# Altium project PT-MIS-PCB-004_v1.PrjPcb
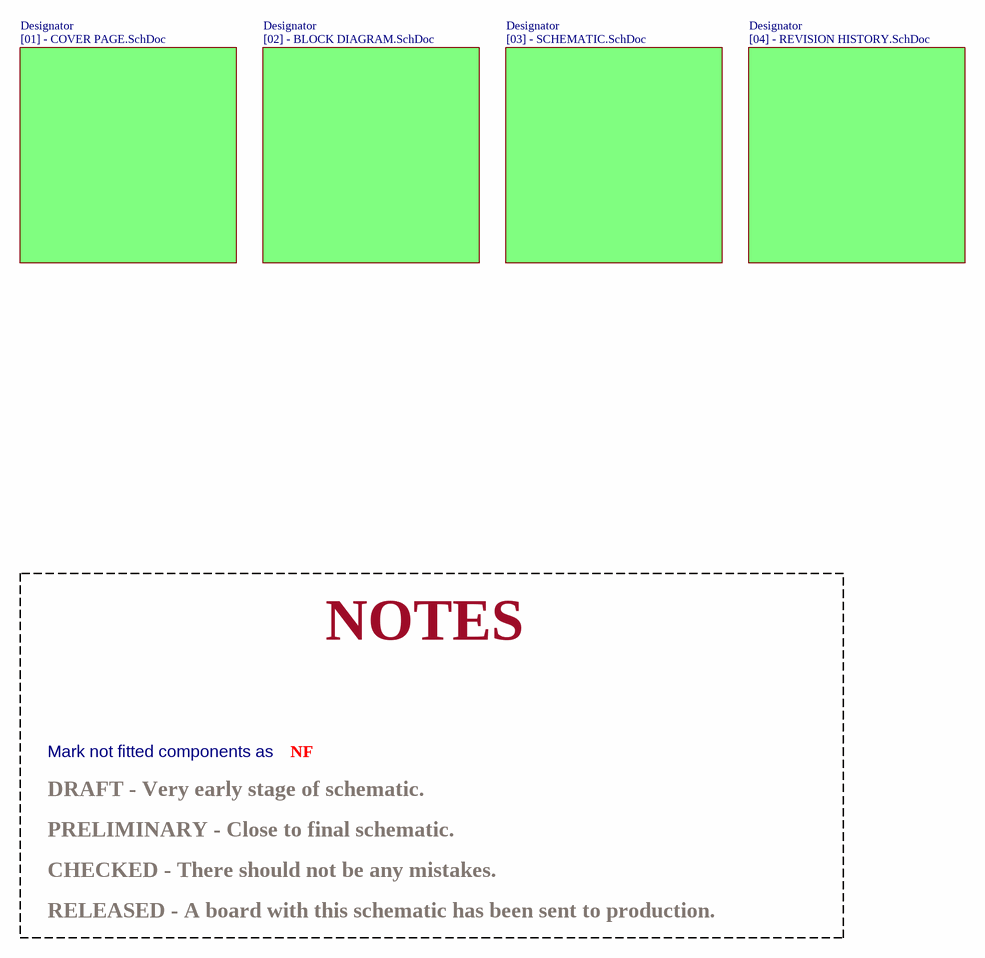
[diagram p0: PT-MIS-PCB-004_v1 Project.SchDoc]
Checked: JABN; DocumentRevision: v1
5 sheets, 68 parts. Net scope: global (net labels, ports and power ports of the same name join across sheets).
Board file: PT-MIS-PCB-004_v1.PcbDoc
Sheets:
  PT-MIS-PCB-004_v1 Project.SchDoc
    Designator = [01] - COVER PAGE.SchDoc
    Designator = [02] - BLOCK DIAGRAM.SchDoc
    Designator = [04] - REVISION HISTORY.SchDoc
    Designator = [03] - SCHEMATIC.SchDoc

## Sheet PT-MIS-PCB-004_v1 Project.SchDoc
size A4; DocumentNumber: 5; SheetNumber: 5; SheetTotal: 5

### Sub-sheets
Designator = [01] - COVER PAGE.SchDoc: no entries
Designator = [02] - BLOCK DIAGRAM.SchDoc: no entries
Designator = [04] - REVISION HISTORY.SchDoc: no entries
Designator = [03] - SCHEMATIC.SchDoc: no entries

### Notes on the sheet
- NOTES
- DRAFT - Very early stage of schematic.
- Mark not fitted components as
- NF
- PRELIMINARY - Close to final schematic.
- CHECKED - There should not be any mistakes.
- RELEASED - A board with this schematic has been sent to production.
- Project:
- Page Contents:
- Size:
- Revision:
- A4
- Document Number:
- Design:
- Date:
- Sheet
- of

## Sheet [01] - COVER PAGE.SchDoc
size A4; DocumentNumber: 1; SheetNumber: 1; SheetTotal: 5
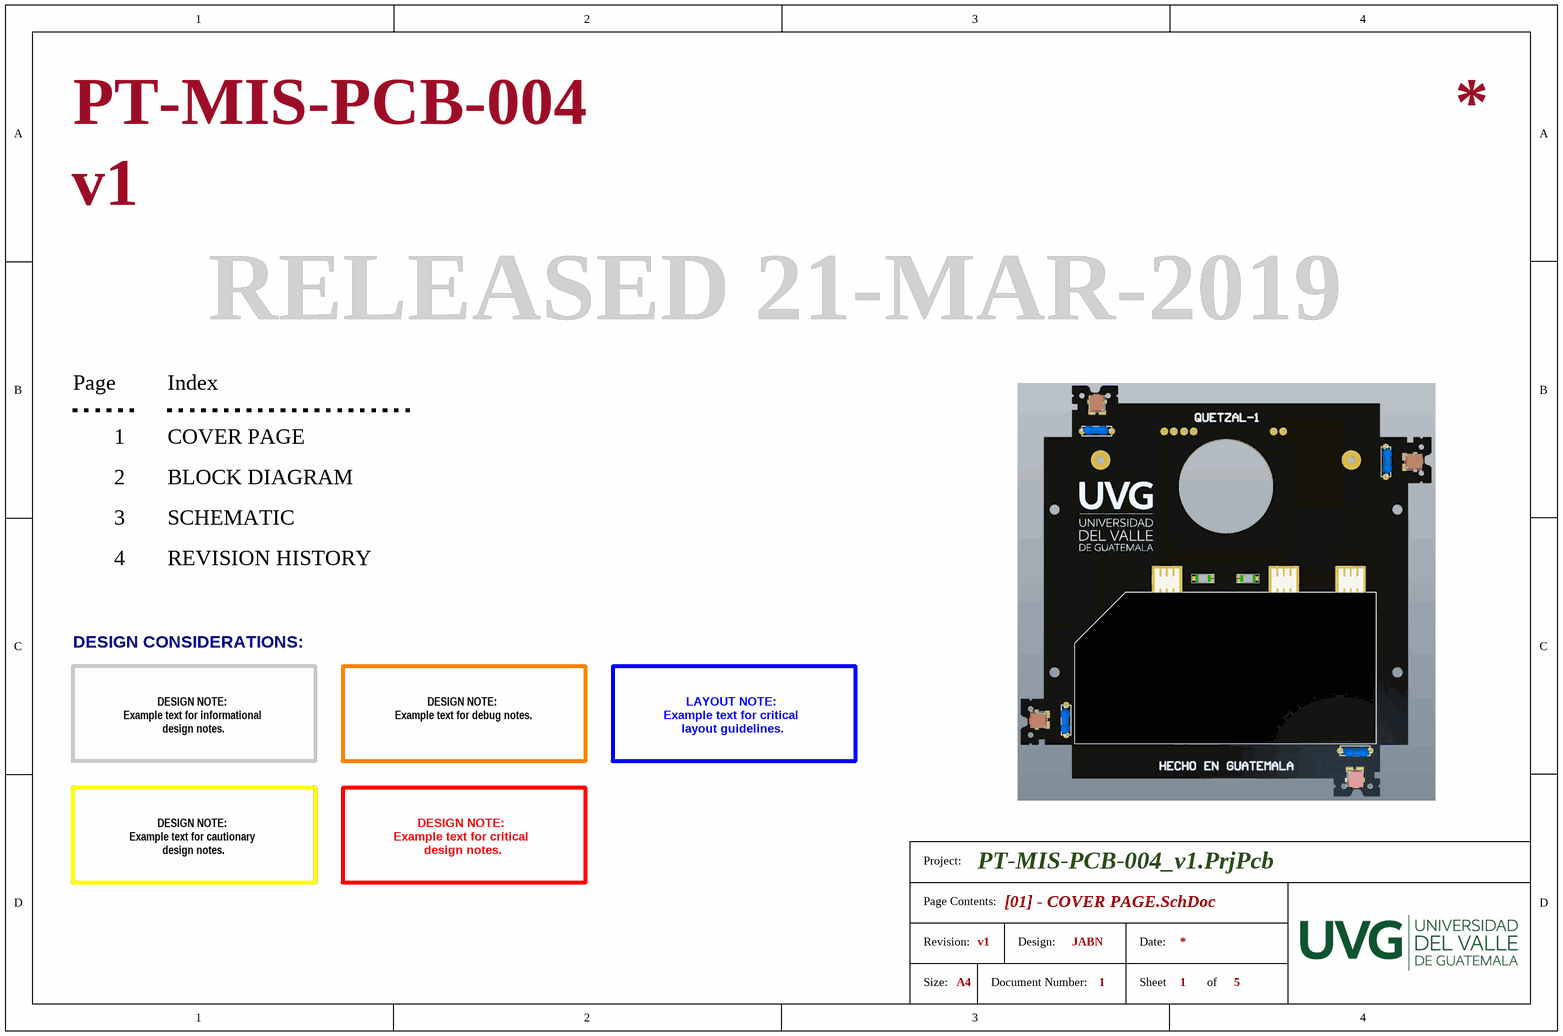
[diagram p1: [01] - COVER PAGE.SchDoc]

### Notes on the sheet
- PT-MIS-PCB-004
- RELEASED 21-MAR-2019
- Page
- 1
- Index
- COVER PAGE
- 2
- BLOCK DIAGRAM
- 3
- 4
- SCHEMATIC
- REVISION HISTORY
- DESIGN CONSIDERATIONS:
- DESIGN NOTE:
  Example text for debug notes.
- DESIGN NOTE:
  Example text for informational
  design notes.
- LAYOUT NOTE:
  Example text for critical
  layout guidelines.
- DESIGN NOTE:
  Example text for cautionary
  design notes.
- DESIGN NOTE:
  Example text for critical
  design notes.
- Project:
- Page Contents:
- Size:
- Revision:
- A4
- Document Number:
- Design:
- Date:
- Sheet
- of

## Sheet [02] - BLOCK DIAGRAM.SchDoc
size A4; DocumentNumber: 2; SheetNumber: 2; SheetTotal: 5
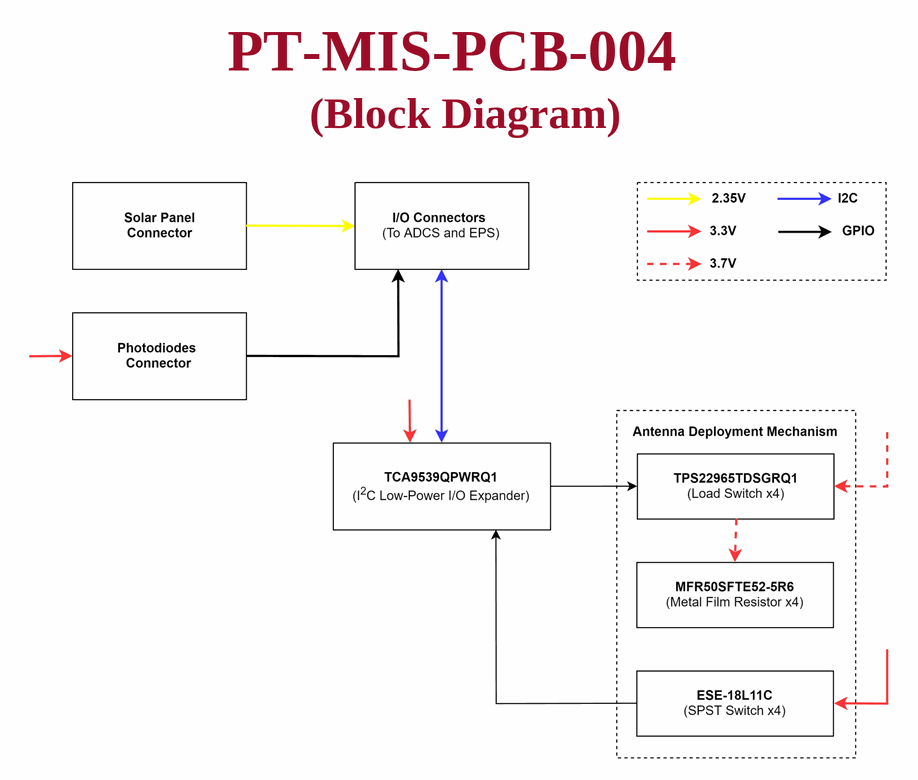
[diagram p2: [02] - BLOCK DIAGRAM.SchDoc]

### Notes on the sheet
- PT-MIS-PCB-004
- (Block Diagram)
- Project:
- Page Contents:
- Size:
- Revision:
- A4
- Document Number:
- Design:
- Date:
- Sheet
- of

## Sheet [04] - REVISION HISTORY.SchDoc
size A4; DocumentNumber: 4; SheetNumber: 4; SheetTotal: 5
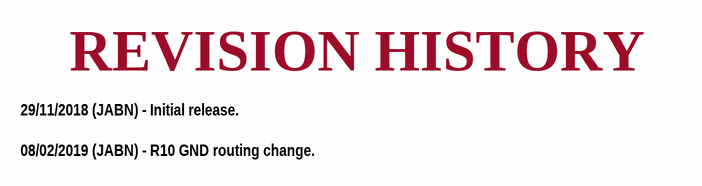
[diagram p3: [04] - REVISION HISTORY.SchDoc]

### Notes on the sheet
- 29/11/2018 (JABN) - Initial release.
- REVISION HISTORY
- 08/02/2019 (JABN) - R10 GND routing change.
- Project:
- Page Contents:
- Size:
- Revision:
- A4
- Document Number:
- Design:
- Date:
- Sheet
- of

## Sheet [03] - SCHEMATIC.SchDoc
size A2; DocumentNumber: 3; SheetNumber: 3; SheetTotal: 5
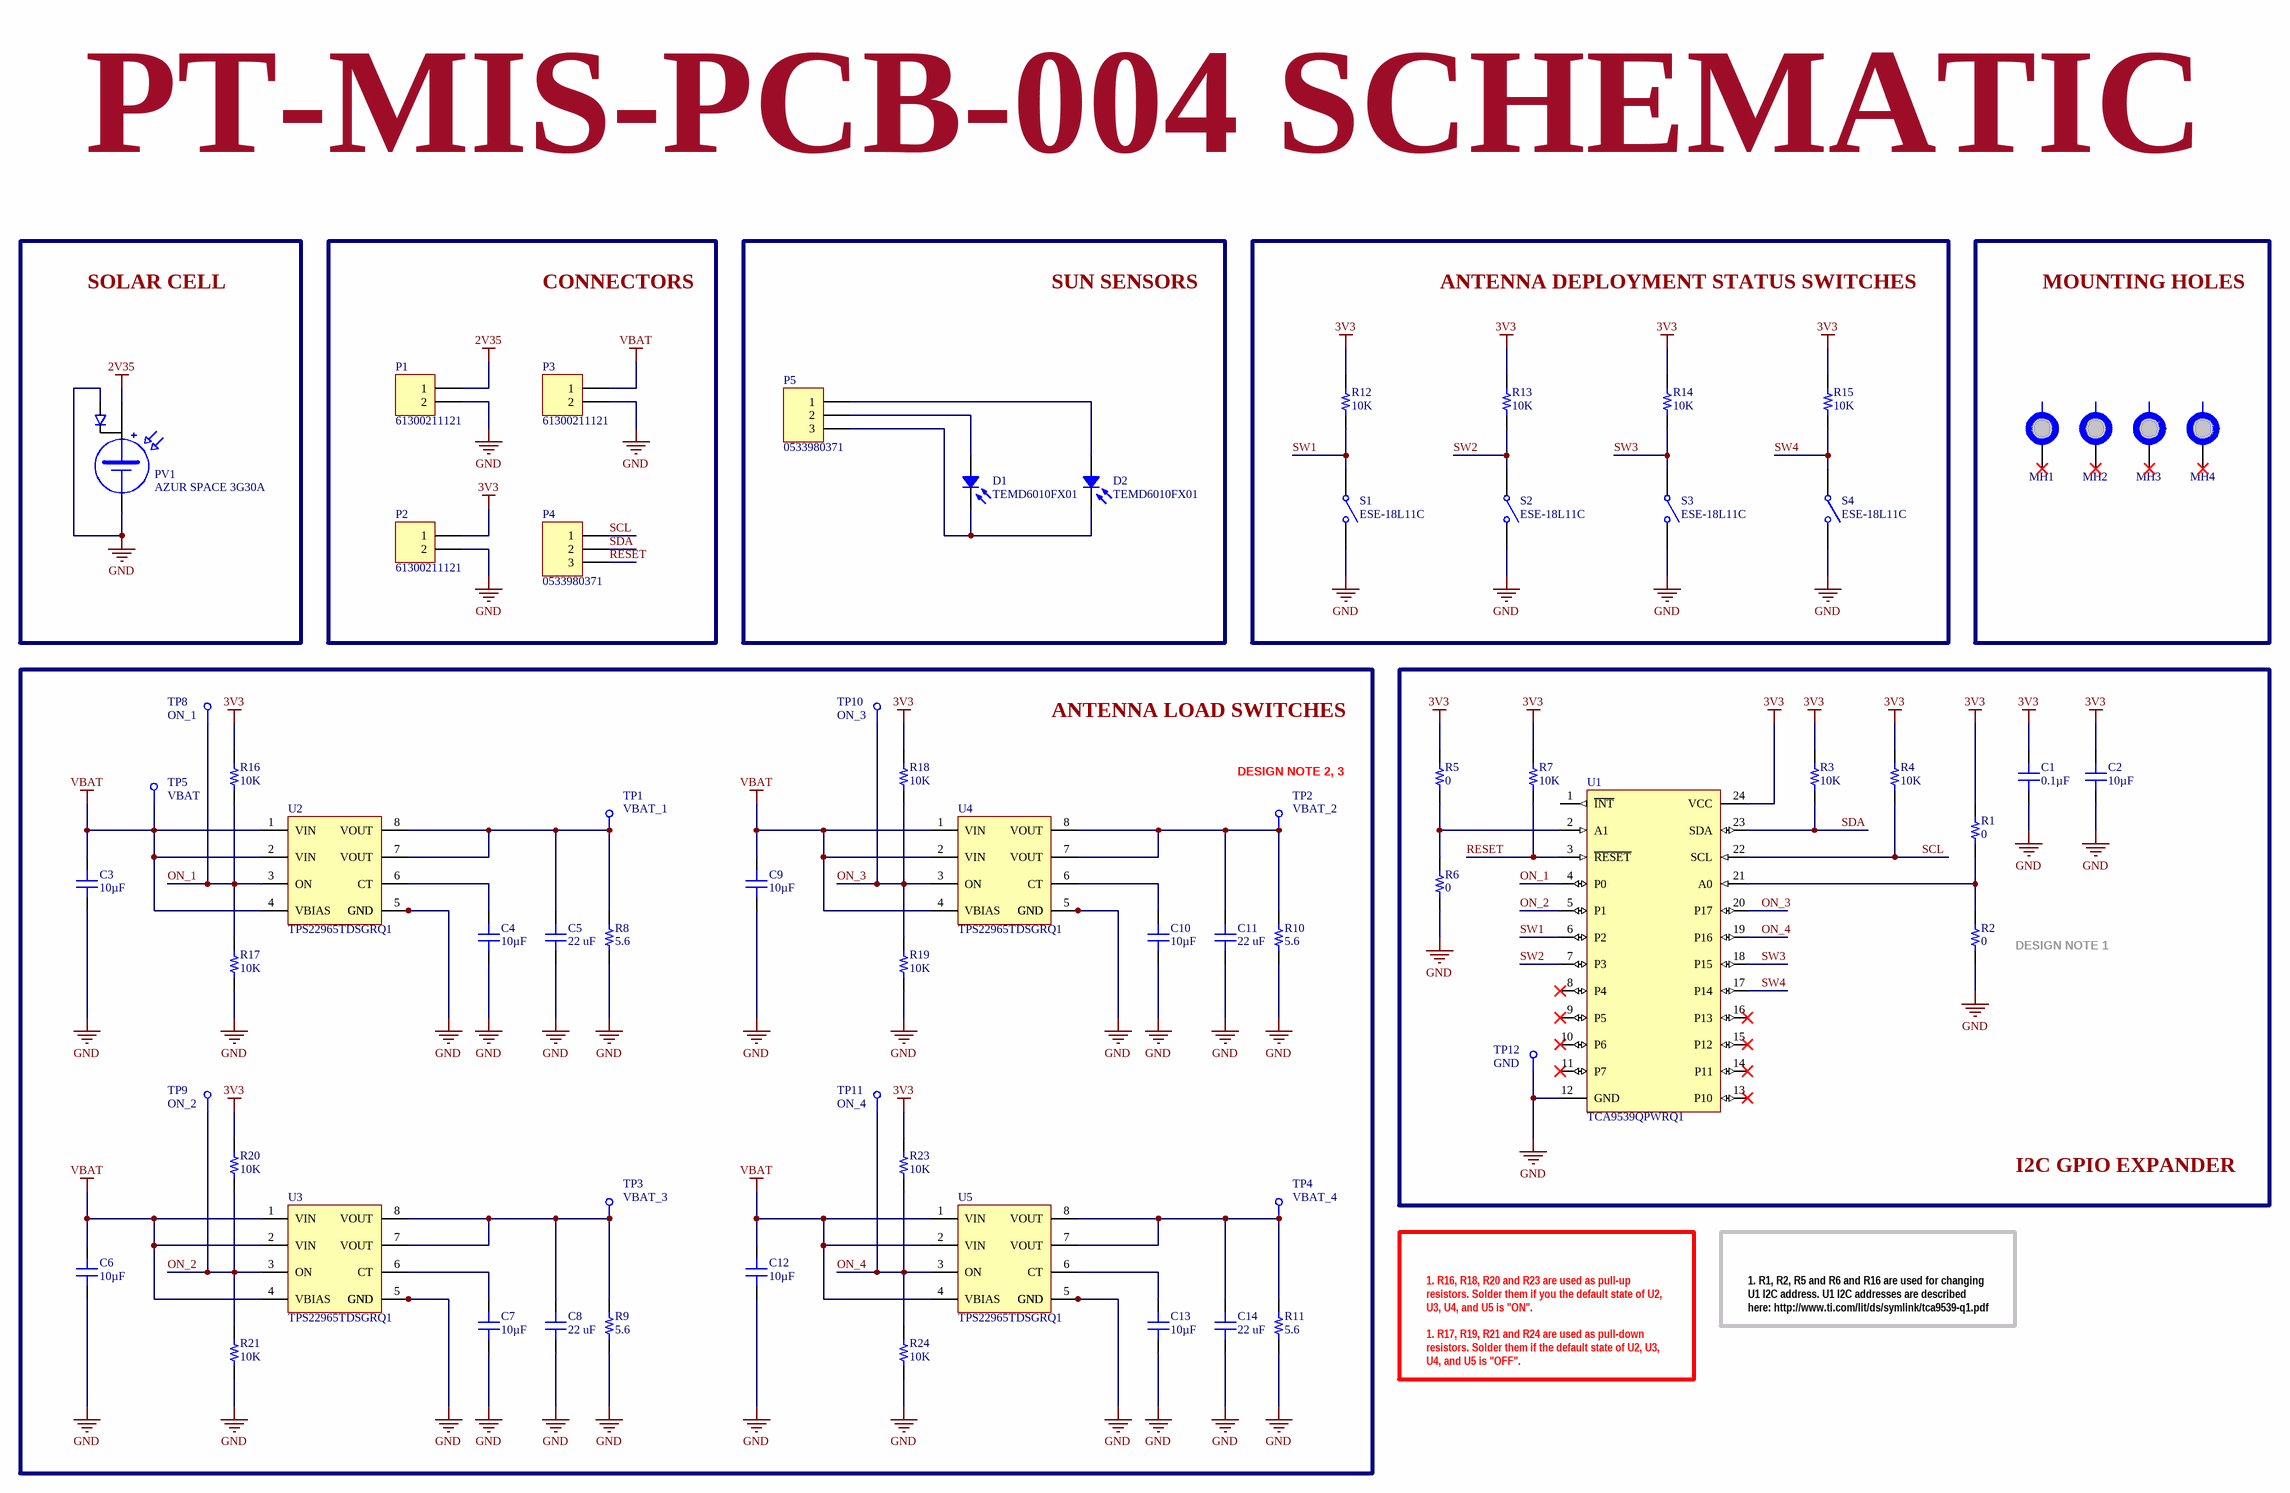
[diagram p4: [03] - SCHEMATIC.SchDoc]

### Parts
C1  0.1µF  [CAP 0805/2012]
C2  Capacitance: 10µF  [CAP 0805/2012]  (hidden comment: LMK212BJ106KG-T)
C3  Capacitance: 10µF  [CAP 0805/2012]  (hidden comment: LMK212BJ106KG-T)
C4  Capacitance: 10µF  [CAP 0805/2012]  (hidden comment: LMK212BJ106KG-T)
C5  Capacitance: 22 uF  [CAP 0805/2012]  (hidden comment: GRM21BR61E226ME44L)
C6  Capacitance: 10µF  [CAP 0805/2012]  (hidden comment: LMK212BJ106KG-T)
C7  Capacitance: 10µF  [CAP 0805/2012]  (hidden comment: LMK212BJ106KG-T)
C8  Capacitance: 22 uF  [CAP 0805/2012]  (hidden comment: GRM21BR61E226ME44L)
C9  Capacitance: 10µF  [CAP 0805/2012]  (hidden comment: LMK212BJ106KG-T)
C10  Capacitance: 10µF  [CAP 0805/2012]  (hidden comment: LMK212BJ106KG-T)
C11  Capacitance: 22 uF  [CAP 0805/2012]  (hidden comment: GRM21BR61E226ME44L)
C12  Capacitance: 10µF  [CAP 0805/2012]  (hidden comment: LMK212BJ106KG-T)
C13  Capacitance: 10µF  [CAP 0805/2012]  (hidden comment: LMK212BJ106KG-T)
C14  Capacitance: 22 uF  [CAP 0805/2012]  (hidden comment: GRM21BR61E226ME44L)
D1  TEMD6010FX01  [TEMD6010FX01]
D2  TEMD6010FX01  [TEMD6010FX01]
MH1  MH_3.8MMNC_2.5MMD  [MH_3.8MMNC_2.5MMD_NON_COPPER_NPTH]  (value not drawn)  (no BOM)
MH2  MH_3.8MMNC_2.5MMD  [MH_3.8MMNC_2.5MMD_NON_COPPER_NPTH]  (value not drawn)  (no BOM)
MH3  MH_3.8MMNC_2.5MMD  [MH_3.8MMNC_2.5MMD_NON_COPPER_NPTH]  (value not drawn)  (no BOM)
MH4  MH_3.8MMNC_2.5MMD  [MH_3.8MMNC_2.5MMD_NON_COPPER_NPTH]  (value not drawn)  (no BOM)
P1  61300211121  [61300211121]
P2  61300211121  [61300211121]
P3  61300211121  [61300211121]
P4  0533980371  [0533980371]
P5  0533980371  [0533980371]
PV1  AZUR SPACE 3G30A  [AZUR SPACE 3G30A]
R1  0  [RES 0805/2012]
R2  0  [RES 0805/2012]
R3  10K  [RES 0805/2012]
R4  10K  [RES 0805/2012]
R5  0  [RES 0805/2012]
R6  0  [RES 0805/2012]
R7  10K  [RES 0805/2012]
R8  5.6  [MFR50SFTE52-5R6]
R9  5.6  [MFR50SFTE52-5R6]
R10  5.6  [MFR50SFTE52-5R6]
R11  5.6  [MFR50SFTE52-5R6]
R12  10K  [RES 0805/2012]
R13  10K  [RES 0805/2012]
R14  10K  [RES 0805/2012]
R15  10K  [RES 0805/2012]
R16  10K  [RES 0805/2012]
R17  10K  [RES 0805/2012]
R18  10K  [RES 0805/2012]
R19  10K  [RES 0805/2012]
R20  10K  [RES 0805/2012]
R21  10K  [RES 0805/2012]
R23  10K  [RES 0805/2012]
R24  10K  [RES 0805/2012]
S1  ESE-18L11C  [ESE-18L11C]
S2  ESE-18L11C  [ESE-18L11C]
S3  ESE-18L11C  [ESE-18L11C]
S4  ESE-18L11C  [ESE-18L11C]
TP1  Testpoint  [Testpoint]  (value not drawn)
TP2  Testpoint  [Testpoint]  (value not drawn)
TP3  Testpoint  [Testpoint]  (value not drawn)
TP4  Testpoint  [Testpoint]  (value not drawn)
TP5  Testpoint  [Testpoint]  (value not drawn)
TP8  ON_1  [Testpoint]
TP9  ON_2  [Testpoint]
TP10  ON_3  [Testpoint]
TP11  ON_4  [Testpoint]
TP12  GND  [Testpoint]
U1  TCA9539QPWRQ1  [TSOP65P640X120-24N]
U2  TPS22965TDSGRQ1  [SON50P200X80_HS-9N]
U3  TPS22965TDSGRQ1  [SON50P200X80_HS-9N]
U4  TPS22965TDSGRQ1  [SON50P200X80_HS-9N]
U5  TPS22965TDSGRQ1  [SON50P200X80_HS-9N]

### Blocks framed on the sheet
SOLAR CELL: PV1
CONNECTORS: P1-P4
SUN SENSORS: D1 D2 P5
ANTENNA DEPLOYMENT STATUS SWITCHES: R12-R15 S1-S4
MOUNTING HOLES: MH1-MH4
ANTENNA LOAD SWITCHES: C3-C14 R8-R11 R16-R21 R23 R24 TP1-TP5 TP8-TP11 U2-U5
I2C GPIO EXPANDER: C1 C2 R1-R7 TP12 U1

### Nets
2V35: P1.1 PV1.1
3V3: C1.2 C2.2 P2.1 R1.2 R3.2 R4.2 R5.2 R7.2 R12.2 R13.2 R14.2 R15.2 R16.2 R18.2 R20.2 R23.2 U1.24(VCC)
GND: C1.1 C2.1 C3.1 C4.2 C5.1 C6.1 C7.2 C8.1 C9.1 C10.2 C11.1 C12.1 C13.2 C14.1 P1.2 P2.2 P3.2 PV1.2 PV1.3 R2.1 R6.1 R8.1 R9.1 R10.1 R11.1 R17.1 R19.1 R21.1 R24.1 S1.2(NO) S2.2(NO) S3.2(NO) S4.2(NO) TP12.1 U1.12(GND) U2.5(GND) U2.9(GND) U3.5(GND) U3.9(GND) U4.5(GND) U4.9(GND) U5.5(GND) U5.9(GND)
VBAT: C3.2 C6.2 C9.2 C12.2 P3.1 TP5.1 U2.1(VIN) U2.2(VIN) U2.4(VBIAS) U3.1(VIN) U3.2(VIN) U3.4(VBIAS) U4.1(VIN) U4.2(VIN) U4.4(VBIAS) U5.1(VIN) U5.2(VIN) U5.4(VBIAS)
ON_1: R16.1 R17.2 TP8.1 U1.4(P0) U2.3(ON)
ON_2: R20.1 R21.2 TP9.1 U1.5(P1) U3.3(ON)
ON_3: R18.1 R19.2 TP10.1 U1.20(P17) U4.3(ON)
ON_4: R23.1 R24.2 TP11.1 U1.19(P16) U5.3(ON)
RESET: P4.3 R7.1 U1.3(~{RESET})
SCL: P4.1 R4.1 U1.22(SCL)
SDA: P4.2 R3.1 U1.23(SDA)
SW1: R12.1 S1.1(COMMON) U1.6(P2)
SW2: R13.1 S2.1(COMMON) U1.7(P3)
SW3: R14.1 S3.1(COMMON) U1.18(P15)
SW4: R15.1 S4.1(COMMON) U1.17(P14)
NetC4_1: C4.1 U2.6(CT)
NetC5_2: C5.2 R8.2 TP1.1 U2.7(VOUT) U2.8(VOUT)
NetC7_1: C7.1 U3.6(CT)
NetC8_2: C8.2 R9.2 TP3.1 U3.7(VOUT) U3.8(VOUT)
NetC10_1: C10.1 U4.6(CT)
NetC11_2: C11.2 R10.2 TP2.1 U4.7(VOUT) U4.8(VOUT)
NetC13_1: C13.1 U5.6(CT)
NetC14_2: C14.2 R11.2 TP4.1 U5.7(VOUT) U5.8(VOUT)
NetD1_1: D1.1 P5.2
NetD1_2: D1.2 D2.2 P5.3
NetD2_1: D2.1 P5.1
NetR1_1: R1.1 R2.2 U1.21(A0)
NetR5_1: R5.1 R6.2 U1.2(A1)

Not connected (* = marked no-connect by the designer): MH1 1; MH2 1; MH3 1; MH4 1; U1 1(~{INT}) 8(P4)* 9(P5)* 10(P6)* 11(P7)* 13(P10)* 14(P11)* 15(P12)* 16(P13)*

### Notes on the sheet
- PT-MIS-PCB-004 SCHEMATIC
- (near TP5) VBAT
- (near TP1) VBAT_1
- (near TP2) DESIGN NOTE 2, 3
- (near TP2) VBAT_2
- (near R2) DESIGN NOTE 1
- (near TP3) VBAT_3
- (near TP4) VBAT_4
- DESIGN NOTES
- 1. R16, R18, R20 and R23 are used as pull-up resistors. Solder them if you the default state of U2, U3, U4, and U5 is "ON".
- 1. R1, R2, R5 and R6 and R16 are used for changing U1 I2C address. U1 I2C addresses are described here: http://www.ti.com/lit/ds/symlink/tca9539-q1.pdf
- 1. R17, R19, R21 and R24 are used as pull-down resistors. Solder them if the default state of U2, U3, U4, and U5 is "OFF".
- Project:
- Page Contents:
- Size:
- Revision:
- A2
- Document Number:
- Design:
- Date:
- Sheet
- of

### Library data of the parts
C1 = C0805C104Z3VACTU: Multilayer Ceramic Capacitors MLCC - SMD/SMT 25volts 0.1uF Y5V -20+80%; Manufacturer: KEMET; Part # Aliases: C0805C104Z3VAC7800; Capacitance - nF: 100 nF; Capacitance - pF: 100000 pF; Voltage Rating: 25 V; Tolerance: - 20 %, + 80 %; Case Height: 0.9 mm; Case Length: 2 mm; Case Width: 1.2 mm; Class: 3; Dissipation Factor DF: 7; Temperature Coefficient / Code: - 82 %, + 22 %; Type: Y5V Dielectric, Commercial; Supplier 1: Digi-Key; Manufacturer Part Number: C0805C104Z3VACTU; Stock 1: 70310; Pricing 1: 1=0.1, 10=0.065, 100=0.0289, 500=0.0207, 1000=0.0162 (USD); Dimensions: 1.2 mm W x 2 mm L x 0.9 mm H; Product Category: Multilayer Ceramic Capacitors MLCC - SMD/SMT; RoHS: Details; Brand: Kemet; Capacitance: 0.1 uF; Voltage Rating DC: 25 V; Dielectric: Y5V; Case Code - in: 0805; Case Code - mm: 2012; Minimum Operating Temperature: - 30 C; Maximum Operating Temperature: + 85 C; Product: General Type MLCCs; Lead Spacing: 0.75 mm; Operating Temperature Range: - 30 C to + 85 C; Package / Case: 0805 (2012 metric); Packaging: Reel; Series: C0805C; Factory Pack Quantity: 4000; Termination Style: SMD/SMT; ComponentLink1URL: http://www.farnell.com/datasheets/2112180.pdf; ComponentLink1Description: http://www.farnell.com/datasheets/2112180.pdf; ComponentLink2URL: http://www.mouser.com/ds/2/212/KEM_C1005_Y5V_SMD-1101305.pdf; ComponentLink2Description: http://www.mouser.com/ds/2/212/KEM_C1005_Y5V_SMD-1101305.pdf; ComponentLink3URL: https://search.kemet.com/component-edge/download/datasheet/C0805C104Z3VACTU.pdf; ComponentLink3Description: https://search.kemet.com/component-edge/download/datasheet/C0805C104Z3VACTU.pdf; ComponentLink4URL: http://capacitoredge.kemet.com/capedge2/DataSheet?pn=C0805C104Z3VACTU; ComponentLink4Description: http://capacitoredge.kemet.com/capedge2/DataSheet?pn=C0805C104Z3VACTU; ComponentLink5URL: http://components.arrow.com/part/dataview/2091117S3443012N7429; ComponentLink5Description: http://components.arrow.com/part/dataview/2091117S3443012N7429; Supplier Part Number 1: 399-9158-1-ND
C2-C4 C6 C7 C9 C10 C12 C13 = LMK212BJ106KG-T: CAP CER 10UF 10V X5R 0805; Manufacturer: Taiyo Yuden; PCN Part Number: X5R, X7R Dielectrics 23/Jan/2008; Catalog Drawings: xMK Series_0805_1.25; Featured Product: Multilayer Chip Capacitors; Tolerance: ±10%; Online Catalog: M Series; Kits: 587-1797-KIT-ND  - KIT CAP CER HI CAP 0603 & 0805 S; Other Names: 587-1300-1; Supplier 1: Digi-Key; Manufacturer Part Number: LMK212BJ106KG-T; Stock 1: 858762; Pricing 1: 1=0.14, 10=0.1, 100=0.0468, 500=0.0328, 1000=0.0272 (USD); Standard Package: 1; Category: Capacitors; Family: Ceramic Capacitors; Series: M; Packaging: Cut Tape (CT); Voltage - Rated: 10V; Temperature Coefficient: X5R; Mounting Type: Surface Mount, MLCC; Operating Temperature: -55°C ~ 85°C; Applications: General Purpose; Ratings: -; Package / Case: 0805 (2012 Metric); Size / Dimension: 0.079" L x 0.049" W (2.00mm x 1.25mm); Height - Seated (Max): -; Thickness (Max): 0.053" (1.35mm); Lead Spacing: -; Features: -; Lead Style: -; ComponentLink1URL: https://datasheet.ciiva.com/26872/getdatasheetpartid-638410-26872692.pdf; ComponentLink1Description: https://datasheet.ciiva.com/26872/getdatasheetpartid-638410-26872692.pdf; ComponentLink2URL: https://datasheet.ciiva.com/7975/1497285-7975797.pdf; ComponentLink2Description: https://datasheet.ciiva.com/7975/1497285-7975797.pdf; ComponentLink3URL: https://datasheet.ciiva.com/7975/1497285-7975799.pdf; ComponentLink3Description: https://datasheet.ciiva.com/7975/1497285-7975799.pdf; ComponentLink4URL: https://datasheet.ciiva.com/135/mlcc-all-e-135133.pdf; ComponentLink4Description: https://datasheet.ciiva.com/135/mlcc-all-e-135133.pdf; ComponentLink5URL: https://datasheet.ciiva.com/135/mlcc-all-e-135134.pdf; ComponentLink5Description: https://datasheet.ciiva.com/135/mlcc-all-e-135134.pdf; ComponentLink6URL: https://datasheet.ciiva.com/30259/719lmk212abj106kg-t-30259022.pdf; ComponentLink6Description: https://datasheet.ciiva.com/30259/719lmk212abj106kg-t-30259022.pdf; ComponentLink7URL: https://datasheet.ciiva.com/135/mlcc-all-e-135135.pdf; ComponentLink7Description: https://datasheet.ciiva.com/135/mlcc-all-e-135135.pdf; Supplier Part Number 1: 587-1300-1-ND
C5 C8 C11 C14 = GRM21BR61E226ME44L: MURATA         GRM21BR61E226ME44L             SMD Multilayer Ceramic Capacitor, 0805 [2012 Metric], 22 F, 25 V,  20%, X5R, GRM Series; Voltage Rating DC: 25 VDC; Brand: Murata Electronics; Class: Class 2; Type: General Purpose Ceramic Capacitors; Unit Weight: 0.000335 oz; Supplier 1: Digi-Key; Manufacturer: Murata; Manufacturer Part Number: GRM21BR61E226ME44L; Stock 1: 146; Pricing 1: 1=0.46, 10=0.316, 100=0.1898, 500=0.1423, 1000=0.1202 (USD); Product Category: Multilayer Ceramic Capacitors MLCC - SMD/SMT; RoHS: True; Dielectric: X5R; Tolerance: 20 %; Case Code - in: 0805; Case Code - mm: 2012; Height: 1.25 mm; Maximum Operating Temperature: + 85 C; Minimum Operating Temperature: - 55 C; Product: General Type MLCCs; Series: GRM; Packaging: Reel; Length: 2 mm; Package / Case: 0805 (2012 metric); Factory Pack Quantity: 3000; Termination Style: SMD/SMT; Width: 1.25 mm; ComponentLink1URL: https://datasheet.ciiva.com/22787/1747471-22787265.pdf; ComponentLink1Description: https://datasheet.ciiva.com/22787/1747471-22787265.pdf; ComponentLink2URL: https://datasheet.ciiva.com/7719/1747471-7719095.pdf; ComponentLink2Description: https://datasheet.ciiva.com/7719/1747471-7719095.pdf; ComponentLink3URL: https://datasheet.ciiva.com/28584/1747471-28584199.pdf; ComponentLink3Description: https://datasheet.ciiva.com/28584/1747471-28584199.pdf; Supplier Part Number 1: 490-10749-1-ND
D1 D2 = TEMD6010FX01: Ambient Light Sensor; Manufacturer: Vishay Semiconductors; Product Training Modules: Ambient Light Sensors; Catalog Drawings: TEMx60x0(F)X01; Featured Product: Surface-Mount Ambient Light Sensing Photodiodes; Wavelength: 540nm; Spectral Range: 430nm ~ 610nm; Diode Type: PIN; Voltage - DC Reverse (Vr) (Max): 16V; Current - Dark (Typ): 2nA; Active Area: 0.27mm²; Viewing Angle: 120°; Other Names: 751-1051-2; Supplier 1: Digi-Key; Manufacturer Part Number: TEMD6010FX01; Stock 1: 29; Pricing 1: 1=2.26, 10=1.998, 25=1.4824, 100=1.2892, 250=1.1603, 500=1.0314, 1000=0.8863 (USD); Standard Package: 3,000; Category: Sensors, Transducers; Family: Optical Sensors - Photodiodes; Packaging: Tape & Reel (TR); Operating Temperature: -40°C ~ 100°C; Mounting Type: Surface Mount; Online Catalog: Ambient Light Sensor; ComponentLink1URL: https://datasheet.ciiva.com/8280/temd6010-8280593.pdf; ComponentLink1Description: https://datasheet.ciiva.com/8280/temd6010-8280593.pdf; ComponentLink2URL: https://datasheet.ciiva.com/1252/temd6010-1252130.pdf; ComponentLink2Description: https://datasheet.ciiva.com/1252/temd6010-1252130.pdf; ComponentLink3URL: https://datasheet.ciiva.com/2819/temd6010-2819730.pdf; ComponentLink3Description: https://datasheet.ciiva.com/2819/temd6010-2819730.pdf; ComponentLink4URL: https://datasheet.ciiva.com/2819/temd6010-2819731.pdf; ComponentLink4Description: https://datasheet.ciiva.com/2819/temd6010-2819731.pdf; ComponentLink5URL: https://datasheet.ciiva.com/2819/temd6010-2819732.pdf; ComponentLink5Description: https://datasheet.ciiva.com/2819/temd6010-2819732.pdf; ComponentLink6URL: https://datasheet.ciiva.com/4270/temd6010-4270070.pdf; ComponentLink6Description: https://datasheet.ciiva.com/4270/temd6010-4270070.pdf; ComponentLink7URL: https://datasheet.ciiva.com/46430/1794172-46430214.pdf; ComponentLink7Description: https://datasheet.ciiva.com/46430/1794172-46430214.pdf; ComponentLink8URL: https://datasheet.ciiva.com/1249/temd6010-1249179.pdf; ComponentLink8Description: https://datasheet.ciiva.com/1249/temd6010-1249179.pdf; ComponentLink9URL: https://datasheet.ciiva.com/4697/temd6010-102586-4697659.pdf; ComponentLink9Description: https://datasheet.ciiva.com/4697/temd6010-102586-4697659.pdf; Supplier Part Number 1: 751-1051-1-ND
MH1-MH4 = MH_3.8MMNC_2MMD: Mounting Hole 3.8mm Diameter (Non Copper), 2.5mm Drill NPTH
P1-P3 = 61300211121: Headers & Wire Housings WR-PHD 2.54mm Header 2P THT; Manufacturer: Wurth Electronics; Current Rating: 3A; Voltage Rating: 250V; Number of Positions: 2; Gender: Male; Connector Type: Male Pin; Pitch: 0.1inch; Supplier 1: Digi-Key; Manufacturer Part Number: 61300211121; Stock 1: 98753; Pricing 1: 1=0.13, 10=0.106, 25=0.088, 50=0.074, 100=0.067, 1000=0.061 (USD); Mount: Through Hole; Contact Plating: Gold; Housing Material: PBT; Contact Material: Copper,Copper Alloy; Colour: Black; Min Operating Temperature: -40°C; Max Operating Temperature: 125°C; Number of Rows: 1; Contact Gender: Male; Packaging: Bulk; Termination: Through Hole; Number of Contacts: 2; Contact Mating Length: 0.236inch; REACH SVHC: Unknown; Lead Free: Lead Free; ComponentLink1URL: https://datasheet.ciiva.com/13619/6130xx11121-48870-13619345.pdf; ComponentLink1Description: https://datasheet.ciiva.com/13619/6130xx11121-48870-13619345.pdf; Supplier Part Number 1: 732-5315-ND
P4 P5 = 0533980371: 3 Positions Header, Shrouded Connector 0.049" (1.25mm) Surface Mount, Vertical Tin; Manufacturer: Molex; Number of Positions: 3; Number of Positions Loaded: All; Supplier 1: Digi-Key; Manufacturer Part Number: 0533980371; Stock 1: 26974; Pricing 1: 1=1.07, 10=0.942, 100=0.8126, 500=0.6649 (USD); Category: Connectors, Interconnects; Family: Rectangular Connectors - Headers, Male Pins; Series: PicoBlade™ 53398; Packaging: Digi-Reel®; Contact Type: Blade Pin; Connector Type: Header, Shrouded; Pitch: 0.049" (1.25mm); Number of Rows: 1; Row Spacing: -; Contact Mating Length: -; Mounting Type: Surface Mount; Termination: Solder; Fastening Type: -; Features: Solder Retention; Contact Finish: Tin; Contact Finish Thickness: 39µin (1.00µm); Color: Natural; ComponentLink1URL: https://datasheet.ciiva.com/6813/533980271-sd-6813860.pdf; ComponentLink1Description: https://datasheet.ciiva.com/6813/533980271-sd-6813860.pdf; ComponentLink2URL: https://datasheet.ciiva.com/3117/0533980371-pcb-headers-3117626.pdf; ComponentLink2Description: https://datasheet.ciiva.com/3117/0533980371-pcb-headers-3117626.pdf; ComponentLink3URL: https://datasheet.ciiva.com/3117/0533980371-pcb-headers-3117627.pdf; ComponentLink3Description: https://datasheet.ciiva.com/3117/0533980371-pcb-headers-3117627.pdf; Supplier Part Number 1: WM7607CT-ND
PV1 = AZUR SPACE 3G30A: 30% Triple Junction GaAs Solar Cell Assembly; Average Open Circuit (BOL): 2690 mV; Average Short Circuit (BOL): 519.6 mA; Voltage at max.Power: 2409 mV; Current at max. Power: 502.9 mA; Average Efficiency (1367 W/m^2): 29.3; Average Efficiency (1353 W/m^2): 29.6
R1 R2 R5 R6 = RC0805JR-070RL: YAGEO         RC0805JR-070RL             RES, THICK FILM, 0R, 0.125W, 0805; Resistance: 0mR; Tolerance: 5%; Voltage Rating: 150V; Power Rating: 125mW; Temperature Coefficient: 200ppm/°C; Supplier 1: Digi-Key; Manufacturer: Yageo; Manufacturer Part Number: RC0805JR-070RL; Stock 1: 3499825; Pricing 1: 1=0.1, 10=0.046, 25=0.0332, 50=0.0254, 100=0.0188, 250=0.01432, 500=0.01144, 1000=0.00842 (USD); Case/Package: 0805; Number of Pins: 2; Case Code (Imperial): 0805; Case Code (Metric): 2012; Contact Plating: Tin,Matte; Min Operating Temperature: -55°C; Max Operating Temperature: 155°C; Packaging: Tape and Reel; Voltage Rating (DC): 150V; Termination: SMD/SMT; Composition: Thick Film; Military Standard: Not; Length: 2mm; Height: 0.5mm; Width: 1.25mm; Depth: 1.25mm; Radiation Hardening: No; REACH SVHC: Unknown; Lead Free: Lead Free; ComponentLink1URL: https://datasheet.ciiva.com/7941/1738694-7941861.pdf; ComponentLink1Description: https://datasheet.ciiva.com/7941/1738694-7941861.pdf; ComponentLink2URL: https://datasheet.ciiva.com/7941/1738694-7941862.pdf; ComponentLink2Description: https://datasheet.ciiva.com/7941/1738694-7941862.pdf; ComponentLink3URL: https://datasheet.ciiva.com/11819/0900766b8106beab-11819430.pdf; ComponentLink3Description: https://datasheet.ciiva.com/11819/0900766b8106beab-11819430.pdf; ComponentLink4URL: https://datasheet.ciiva.com/7941/1738694-7941863.pdf; ComponentLink4Description: https://datasheet.ciiva.com/7941/1738694-7941863.pdf; ComponentLink5URL: https://datasheet.ciiva.com/15190/getdatasheetpartid-330685-15190028.pdf; ComponentLink5Description: https://datasheet.ciiva.com/15190/getdatasheetpartid-330685-15190028.pdf; Supplier Part Number 1: 311-0.0ARDKR-ND
R3 R4 R7 R12-R21 R23 R24 = RC0805FR-0710KL: RES SMD 10K OHM 1% 1/8W 0805; Manufacturer: Yageo; Resistance: 10 kOhms; Power Rating: 125 mW (1/8 W); Voltage Rating: 150 V; Temperature Coefficient: 100 PPM / C; Supplier 1: Digi-Key; Manufacturer Part Number: RC0805FR-0710KL; Stock 1: 19355771; Pricing 1: 1=0.1, 10=0.022, 100=0.0088, 1000=0.004, 2500=0.0034 (USD); Termination Style: SMD/SMT; Product: Thick Film Resistors General Purpose; Tolerance: 1 %; Case Code - in: 0805; Case Code - mm: 2012; Series: RC; Operating Temperature Range: - 55 C to + 155 C; Packaging: Reel; ComponentLink1URL: https://datasheet.ciiva.com/11808/0900766b8106beab-11808151.pdf; ComponentLink1Description: https://datasheet.ciiva.com/11808/0900766b8106beab-11808151.pdf; ComponentLink2URL: https://datasheet.ciiva.com/12669/rc0805-12669688.pdf; ComponentLink2Description: https://datasheet.ciiva.com/12669/rc0805-12669688.pdf; ComponentLink3URL: https://datasheet.ciiva.com/46447/444164-46447563.pdf; ComponentLink3Description: https://datasheet.ciiva.com/46447/444164-46447563.pdf; ComponentLink4URL: https://datasheet.ciiva.com/2456/pyu-r-int-thick-7-2456972.pdf; ComponentLink4Description: https://datasheet.ciiva.com/2456/pyu-r-int-thick-7-2456972.pdf; ComponentLink5URL: https://datasheet.ciiva.com/2456/pyu-r-int-thick-7-2456973.pdf; ComponentLink5Description: https://datasheet.ciiva.com/2456/pyu-r-int-thick-7-2456973.pdf; ComponentLink6URL: https://datasheet.ciiva.com/2456/pyu-r-int-thick-7-2456974.pdf; ComponentLink6Description: https://datasheet.ciiva.com/2456/pyu-r-int-thick-7-2456974.pdf; ComponentLink7URL: https://datasheet.ciiva.com/16747/rc0805-16747087.pdf; ComponentLink7Description: https://datasheet.ciiva.com/16747/rc0805-16747087.pdf; Supplier Part Number 1: 311-10.0KCRCT-ND
R8-R11 = MFR50SFTE52-5R6: Metal Film Resistors - Through Hole 5.6 OHM 1/2W 1%; Manufacturer: Yageo; Resistance: 5.6R; Power Rating: 500mW; Voltage Rating: 300V; Supplier 1: Mouser; Manufacturer Part Number: MFR50SFTE52-5R6; Stock 1: 6192; Pricing 1: 1=0.23, 10=0.14, 50=0.14, 100=0.046, 1000=0.032, 10000=0.023 (USD); Case/Package: Metal; Min Operating Temperature: -55°C; Max Operating Temperature: 155°C; Tolerance: 1%; Termination: Axial; Packaging: Ammo Pack; Voltage Rating (DC): 300V; ComponentLink1URL: http://www.mouser.com/ds/2/447/Yageo%20LR_MFR_2013-467719.pdf; ComponentLink1Description: http://www.mouser.com/ds/2/447/Yageo%20LR_MFR_2013-467719.pdf; Supplier Part Number 1: 603-MFR50SFTE52-5R6
S1-S4 = ESE-18L11C: Detector switch,SMT,SPNO,1HL,no boss; Manufacturer: Panasonic ECG; Catalog Drawings: ESE-18L61_F Footprint ESE-18L61_F Circuit NO ESE-18L61_F; 3D Model: ESE18 Series.stp; Circuit: SPST-NO; Switch Function: Off-Mom; Current Rating: 10mA (DC); Voltage Rating - DC: 5V; Actuator Type: Angled Toggle (Detector); Operating Force, Torque: 30gf; Operating Position: 0.102" (2.6mm); Mechanical Life: 50,000 Cycles; Online Catalog: ESE18 Series; Other Names: P14172SDKR; Supplier 1: Digi-Key; Manufacturer Part Number: ESE-18L11C; Stock 1: 9120; Pricing 1: 1=0.61, 10=0.578, 25=0.5544, 50=0.5314, 100=0.5082, 250=0.4042, 500=0.3696, 1000=0.3581 (USD); Standard Package: 1; Category: Switches; Family: Snap Action, Limit Switches; Series: ESE18; Packaging: Digi-Reel®; Voltage Rating - AC: -; Mounting Type: Surface Mount, Right Angle; Termination Style: SMD (SMT) Tab; Ingress Protection: -; Features: -; Release Force: -; Pretravel: -; Differential Travel: -; Overtravel: -; Electrical Life: 50,000 Cycles; Operating Temperature: -10°C ~ 60°C; ComponentLink1URL: https://datasheet.ciiva.com/2890/atb0000ce10-2890776.pdf; ComponentLink1Description: https://datasheet.ciiva.com/2890/atb0000ce10-2890776.pdf; ComponentLink2URL: https://datasheet.ciiva.com/2890/atb0000ce10-2890777.pdf; ComponentLink2Description: https://datasheet.ciiva.com/2890/atb0000ce10-2890777.pdf; ComponentLink3URL: https://datasheet.ciiva.com/2890/atb0000ce10-2890778.pdf; ComponentLink3Description: https://datasheet.ciiva.com/2890/atb0000ce10-2890778.pdf; ComponentLink4URL: https://datasheet.ciiva.com/23620/1520574-23620267.pdf; ComponentLink4Description: https://datasheet.ciiva.com/23620/1520574-23620267.pdf; ComponentLink5URL: https://datasheet.ciiva.com/14143/ese18-eng-tds-14143212.pdf; ComponentLink5Description: https://datasheet.ciiva.com/14143/ese18-eng-tds-14143212.pdf; Supplier Part Number 1: P14172SCT-ND
TP8-TP12 = Testpoint
U1 = TCA9539QPWRQ1: Low Voltage 16-Bit I / 2C and SMBus Low-Power I/O Expander with Interrupt / Output, Reset Pin, and Configuration Registers; Manufacturer: Texas Instruments; Number of I/Os: 16; Interface: I2C,SMBus; Min Supply Voltage: 1.65V; Max Supply Voltage: 3.6V; Frequency: 400kHz; Supplier 1: Digi-Key; Manufacturer Part Number: TCA9539QPWRQ1; Stock 1: 12145; Pricing 1: 1=1.62, 10=1.452, 100=1.1672, 500=0.95894, 1000=0.79454 (USD); Mount: Surface Mount; Case/Package: TSSOP; Number of Pins: 24; Min Operating Temperature: -40°C; Max Operating Temperature: 125°C; Packaging: Cut Tape; Number of Outputs: 16; REACH SVHC: No SVHC; Lead Free: Lead Free; ComponentLink1URL: http://www.ti.com/general/docs/lit/getliterature.tsp?genericPartNumber=TCA9539-Q1&&fileType=pdf; ComponentLink1Description: http://www.ti.com/general/docs/lit/getliterature.tsp?genericPartNumber=TCA9539-Q1&&fileType=pdf; ComponentLink2URL: http://www.ti.com/lit/pdf/sszc003; ComponentLink2Description: http://www.ti.com/lit/pdf/sszc003; ComponentLink3URL: http://www.ti.com/lit/ds/symlink/tca9539-q1.pdf; ComponentLink3Description: http://www.ti.com/lit/ds/symlink/tca9539-q1.pdf; ComponentLink4URL: http://www.ti.com/general/docs/lit/getliterature.tsp?genericPartNumber=TCA9539-Q1&amp;&amp;fileType=pdf; ComponentLink4Description: http://www.ti.com/general/docs/lit/getliterature.tsp?genericPartNumber=TCA9539-Q1&amp;&amp;fileType=pdf; Supplier Part Number 1: 296-44183-6-ND
U2-U5 = TPS22965TDSGRQ1: IC LOAD SWITCH 6A 8WSON; Manufacturer: Texas Instruments; Switch Type: General Purpose; Number of Outputs: 1; Ratio - Input:Output: 1:1; Output Configuration: High Side; Output Type: N-Channel; Interface: On/Off; Voltage - Load: 2.5 V ~ 5.5 V; Voltage - Supply (Vcc/Vdd): 0.8 V ~ 5.5 V; Current - Output (Max): 4A; Rds On (Typ): 16 mOhm; Input Type: Non-Inverting; Supplier 1: Digi-Key; Manufacturer Part Number: TPS22965TDSGRQ1; Stock 1: 10747; Pricing 1: 1=0.89, 10=0.799, 100=0.623, 500=0.5147, 1000=0.4063 (USD); Category: Integrated Circuits (ICs); Family: PMIC - Power Distribution Switches, Load Drivers; Series: Automotive, AEC-Q100; Packaging: Tape & Reel (TR); Features: Load Discharge, Slew Rate Controlled; Fault Protection: -; Operating Temperature: -40°C ~ 105°C (TA); Package / Case: 8-WFDFN Exposed Pad; Supplier Device Package: 8-WSON (2x2); ComponentLink1URL: http://components.arrow.com/part/dataview/66145051S825924N7713; ComponentLink1Description: http://components.arrow.com/part/dataview/66145051S825924N7713; ComponentLink2URL: http://www.ti.com/lit/gpn/tps22965-q1; ComponentLink2Description: http://www.ti.com/lit/gpn/tps22965-q1; ComponentLink3URL: http://www.ti.com/general/docs/lit/getliterature.tsp?genericPartNumber=TPS22965-Q1&&fileType=pdf; ComponentLink3Description: http://www.ti.com/general/docs/lit/getliterature.tsp?genericPartNumber=TPS22965-Q1&&fileType=pdf; ComponentLink4URL: http://www.ti.com/lit/pdf/ssay002; ComponentLink4Description: http://www.ti.com/lit/pdf/ssay002; Supplier Part Number 1: 296-38290-1-ND; Supplier 2: Digi-Key; Supplier Part Number 2: 751-1051-1-ND